# Altium schematic sheet STM32F103C8T6.SchDoc
size A; SheetNumber: 1; SheetTotal: 3
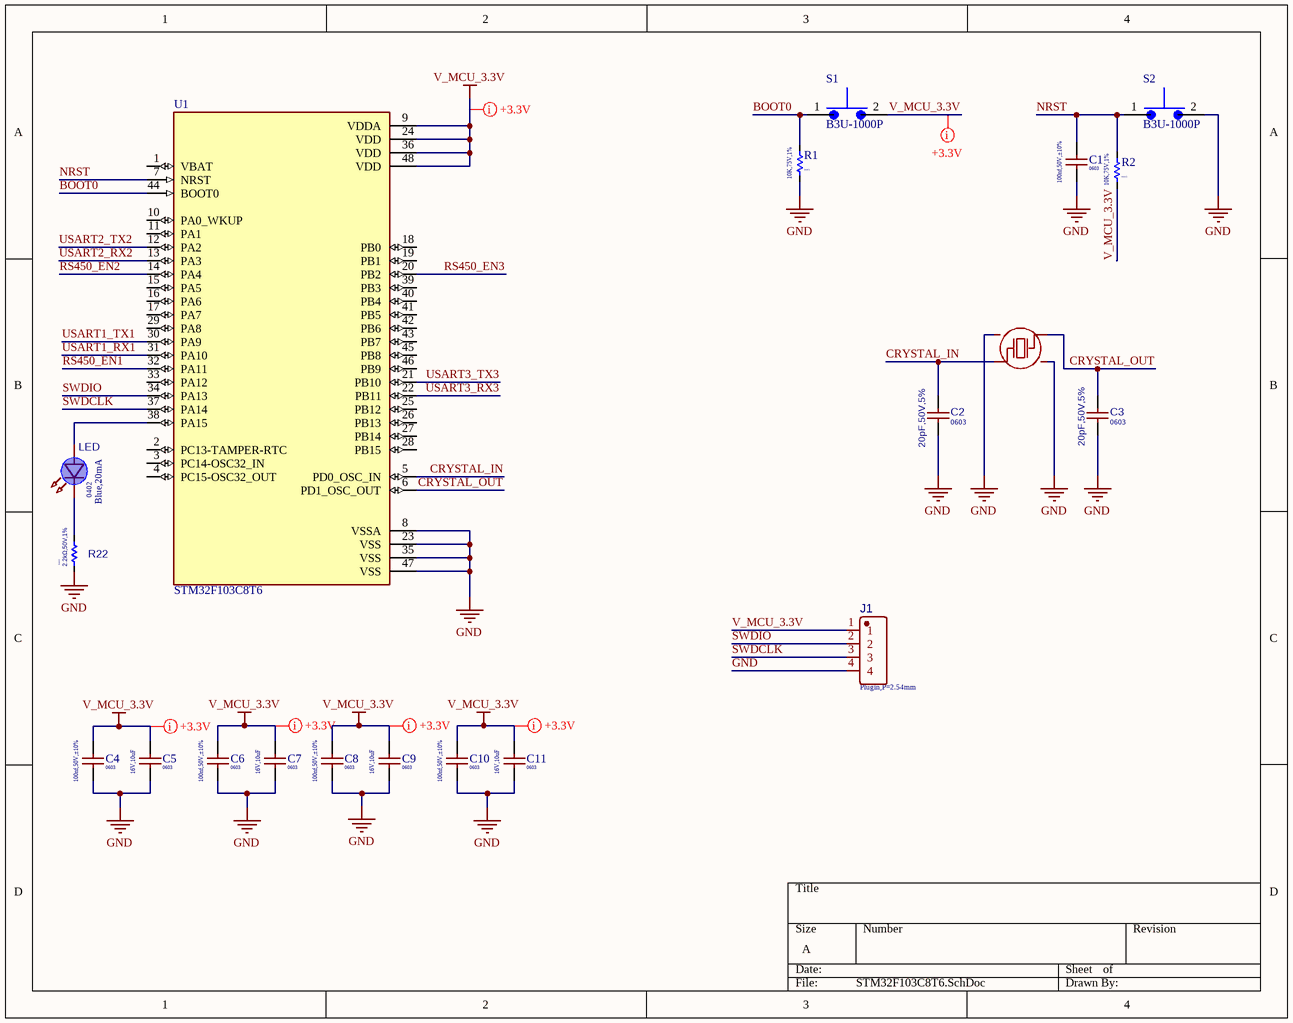
[diagram p0: STM32F103C8T6.SchDoc]

## Parts
C1  value 100nf,50V,±10%  Package: 0603  [C0603]  (hidden comment: CC0603KRX7R9BB104)
C2  value 20pF,50V,5%  Package: 0603  [C0603]  (hidden comment: 20pF)
C3  value 20pF,50V,5%  Package: 0603  [C0603]  (hidden comment: 20pF)
C4  value 100nf,50V,±10%  Package: 0603  [C0603]  (hidden comment: CC0603KRX7R9BB104)
C5  value 16V,10uF  Package: 0603  [CAPC1608X90N]  (hidden comment: 10uf)
C6  value 100nf,50V,±10%  Package: 0603  [C0603]  (hidden comment: CC0603KRX7R9BB104)
C7  value 16V,10uF  Package: 0603  [CAPC1608X90N]  (hidden comment: 10uf)
C8  value 100nf,50V,±10%  Package: 0603  [C0603]  (hidden comment: CC0603KRX7R9BB104)
C9  value 16V,10uF  Package: 0603  [CAPC1608X90N]  (hidden comment: 10uf)
C10  value 100nf,50V,±10%  Package: 0603  [C0603]  (hidden comment: CC0603KRX7R9BB104)
C11  value 16V,10uF  Package: 0603  [CAPC1608X90N]  (hidden comment: 10uf)
J1  Package: Plugin,P=2.54mm  [PIN_4,P=2.54mm]  (hidden comment: *)
LED  value Blue,20mA  Package: 0402  [LED 0402]  (hidden comment: XL-1005UBC)
R1  Package: 0603  [R0603]  (hidden comment: 10K,75V,1%)
R2  Package: 0603  [R0603]  (hidden comment: 10K,75V,1%)
R22  value 2.2kΩ,50V,1%  Package: 0402  [R0402]  (hidden comment: 2.2KΩ)
S1  B3U-1000P  [B3U-1000P]
S2  B3U-1000P  [B3U-1000P]
U1  STM32F103C8T6  [STM32F103C8T6]
X1  8MHz  [SMD3225-4P]  (value not drawn)

## Nets
GND: C1.1 C2.1 C3.1 C4.1 C5.1 C6.1 C7.1 C8.1 C9.1 C10.1 C11.1 J1.4 R1.2 R22.1 S2.2 U1.8(VSSA) U1.23(VSS) U1.35(VSS) U1.47(VSS) X1.2 X1.4
V_MCU_3.3V: C4.2 C5.2 C6.2 C7.2 C8.2 C9.2 C10.2 C11.2 J1.1 R2.2 S1.2 U1.9(VDDA) U1.24(VDD) U1.36(VDD) U1.48(VDD)
BOOT0: R1.1 S1.1 U1.44(BOOT0)
CRYSTAL_IN: C2.2 U1.5(PD0_OSC_IN) X1.1
CRYSTAL_OUT: C3.2 U1.6(PD1_OSC_OUT) X1.3
NRST: C1.2 R2.1 S2.1 U1.7(NRST)
RS450_EN1: U1.32(PA11)
RS450_EN2: U1.14(PA4)
RS450_EN3: U1.20(PB2)
SWDCLK: J1.3 U1.37(PA14)
SWDIO: J1.2 U1.34(PA13)
USART1_RX1: U1.31(PA10)
USART1_TX1: U1.30(PA9)
USART2_RX2: U1.13(PA3)
USART2_TX2: U1.12(PA2)
USART3_RX3: U1.22(PB11)
USART3_TX3: U1.21(PB10)
NetLED_1: LED.1(K) R22.2
NetLED_2: LED.2(A) U1.38(PA15)

Not connected (* = marked no-connect by the designer): U1 1(VBAT) 2(PC13-TAMPER-RTC) 3(PC14-OSC32_IN) 4(PC15-OSC32_OUT) 10(PA0_WKUP) 11(PA1) 15(PA5) 16(PA6) 17(PA7) 18(PB0) 19(PB1) 25(PB12) 26(PB13) 27(PB14) 28(PB15) 29(PA8) 33(PA12) 39(PB3) 40(PB4) 41(PB5) 42(PB6) 43(PB7) 45(PB8) 46(PB9)

## Layout directives
net class +3.3V: V_MCU_3.3V

## Library data of the parts
C1 C4 C6 C8 C10 = CC0603KRX7R9BB104: 50V 100nF X7R ±10% 0603 Multilayer Ceramic Capacitors MLCC - SMD/SMT ROHS; MPN: 603-CC603KRX7R9BB104; Manufacturer: KEMET; Max Operating Temp: 35 °C; Min Operating Temp: 15 °C; Datasheet: http://componentsearchengine.com/Datasheets/3/CC0603KRX7R9BB104.pdf; LCSC: C14663
C2 C3 = CL10C200JB8NNNC: 50V 20pF C0G ±5% 0603 Multilayer Ceramic Capacitors MLCC - SMD/SMT ROHS; Manufacturer: SHOU HAN; Type: *; MPN: CL10C200JB8NNNC; Max Operating Temp: +125; Min Operating Temp: -55; Datasheet: https://datasheet.lcsc.com/lcsc/2304140030_Samsung-Electro-Mechanics-CL10C200JB8NNNC_C1648.pdf; LCSC: C1648
C5 C7 C9 C11 = 0603F106M160NT: 16V 10uF Y5V ±20% 0603 Multilayer Ceramic Capacitors MLCC - SMD/SMT ROHS; Manufacturer: KEMET; MPN: CC0603KRX7R9BB104; Datasheet: http://componentsearchengine.com/Datasheets/3/CC0603KRX7R9BB104.pdf; LCSC: C48906
J1 = PZ254V-11-04P: Straight Square Pins 2.5mm 4P 6mm -40℃~+105℃ 3mm 2.54mm Plugin Black Brass 1x4P Plugin,P=2.54mm Pin Headers ROHS; Manufacturer: XFCN; Min temp: -40°C; Max temp: 105°C; Type: TH; Value: *; Datasheet: https://datasheet.lcsc.com/lcsc/2304140030_XFCN-PZ254V-11-04P_C492403.pdf; MPN: PZ254V-11-04P; LCSC: C2691448
LED = XL-1005UBC: 20mA 240mcd Colorless Transparent Lens -20℃~+85℃ 455nm~475nm Positive Stick Blue 120° 70mW 3.3V 0402 LED Indication - Discrete ROHS; Manufacturer: XINGLIGHT; Datasheet: https://www.lcsc.com/datasheet/lcsc_datasheet_2409271833_XINGLIGHT-XL-1005UBC_C22355736.pdf; LCSC: C22355736; MPN: XL-1005UBC
R1 R2 = 0603WAF1002T5E: 100mW Thick Film Resistors ±100ppm/℃ ±1% 10kΩ 0603 Chip Resistor - Surface Mount ROHS; Manufacturer: UNI-ROYAL(Uniroyal Elec); Max Operating Temp: 155℃; Min Operating Temp: -55℃; MPN: 0603WAF1002T5E; Datasheet: https://datasheet.lcsc.com/szlcsc/Uniroyal-Elec-0603WAF1002T5E_C25804.pdf; LCSC: C25804; Value: 10K,75V,1%
R22 = RC0402FR-072K2L: 62.5mW Thick Film Resistors 50V ±100ppm/℃ ±1% 2.2kΩ 0402 Chip Resistor - Surface Mount ROHS; Manufacturer: YAGEO; Max Operating Temp: +155; MPN: RC0402FR-072K2L; Datasheet: https://datasheet.lcsc.com/lcsc/2304140030_YAGEO-RC0402FR-072K2L_C114762.pdf; Min Operating Temp: -55; LCSC: C114762
S1 S2 = B3U-1000P: 2.5mm 1.6mm Round Button 50mA Brick nogging 3mm SPST 153gf 12V SMD,2.5x3mm Tactile Switches ROHS; Manufacturer: Omron Electronics; MPN: 653-B3U-1000P; Datasheet: https://www.omron.com/ecb/products/pdf/en-b3u.pdf; LCSC: C231329
U1 = STM32F103C8T6: Mainstream Performance line, ARM Cortex-M3 MCU with 64 Kbytes Flash, 72 MHz CPU, motor control, USB and CAN; Manufacturer: STMicroelectronics; Value: *; Package: LQFP-48(7x7); Datasheet: https://datasheet.lcsc.com/lcsc/2302211130_STMicroelectronics-STM32F103C8T6_C8734.pdf; LCSC: C8734
X1 = X32258MSB4SI: 8MHz Surface Mount Crystal 20pF ±10ppm ±20ppm SMD3225-4P Crystals ROHS; Manufacturer: YXC; LCSC: C2682774; MPN: X32258MSB4SI; Package: SMD3225-4P; Datasheet: https://www.lcsc.com/datasheet/lcsc_datasheet_2411121006_YXC-Crystal-Oscillators-X32258MSB4SI_C2682774.pdf; Operating Temperature: -40℃~+85℃